# EAGLE design goodfet24 (EAGLE 5.08)
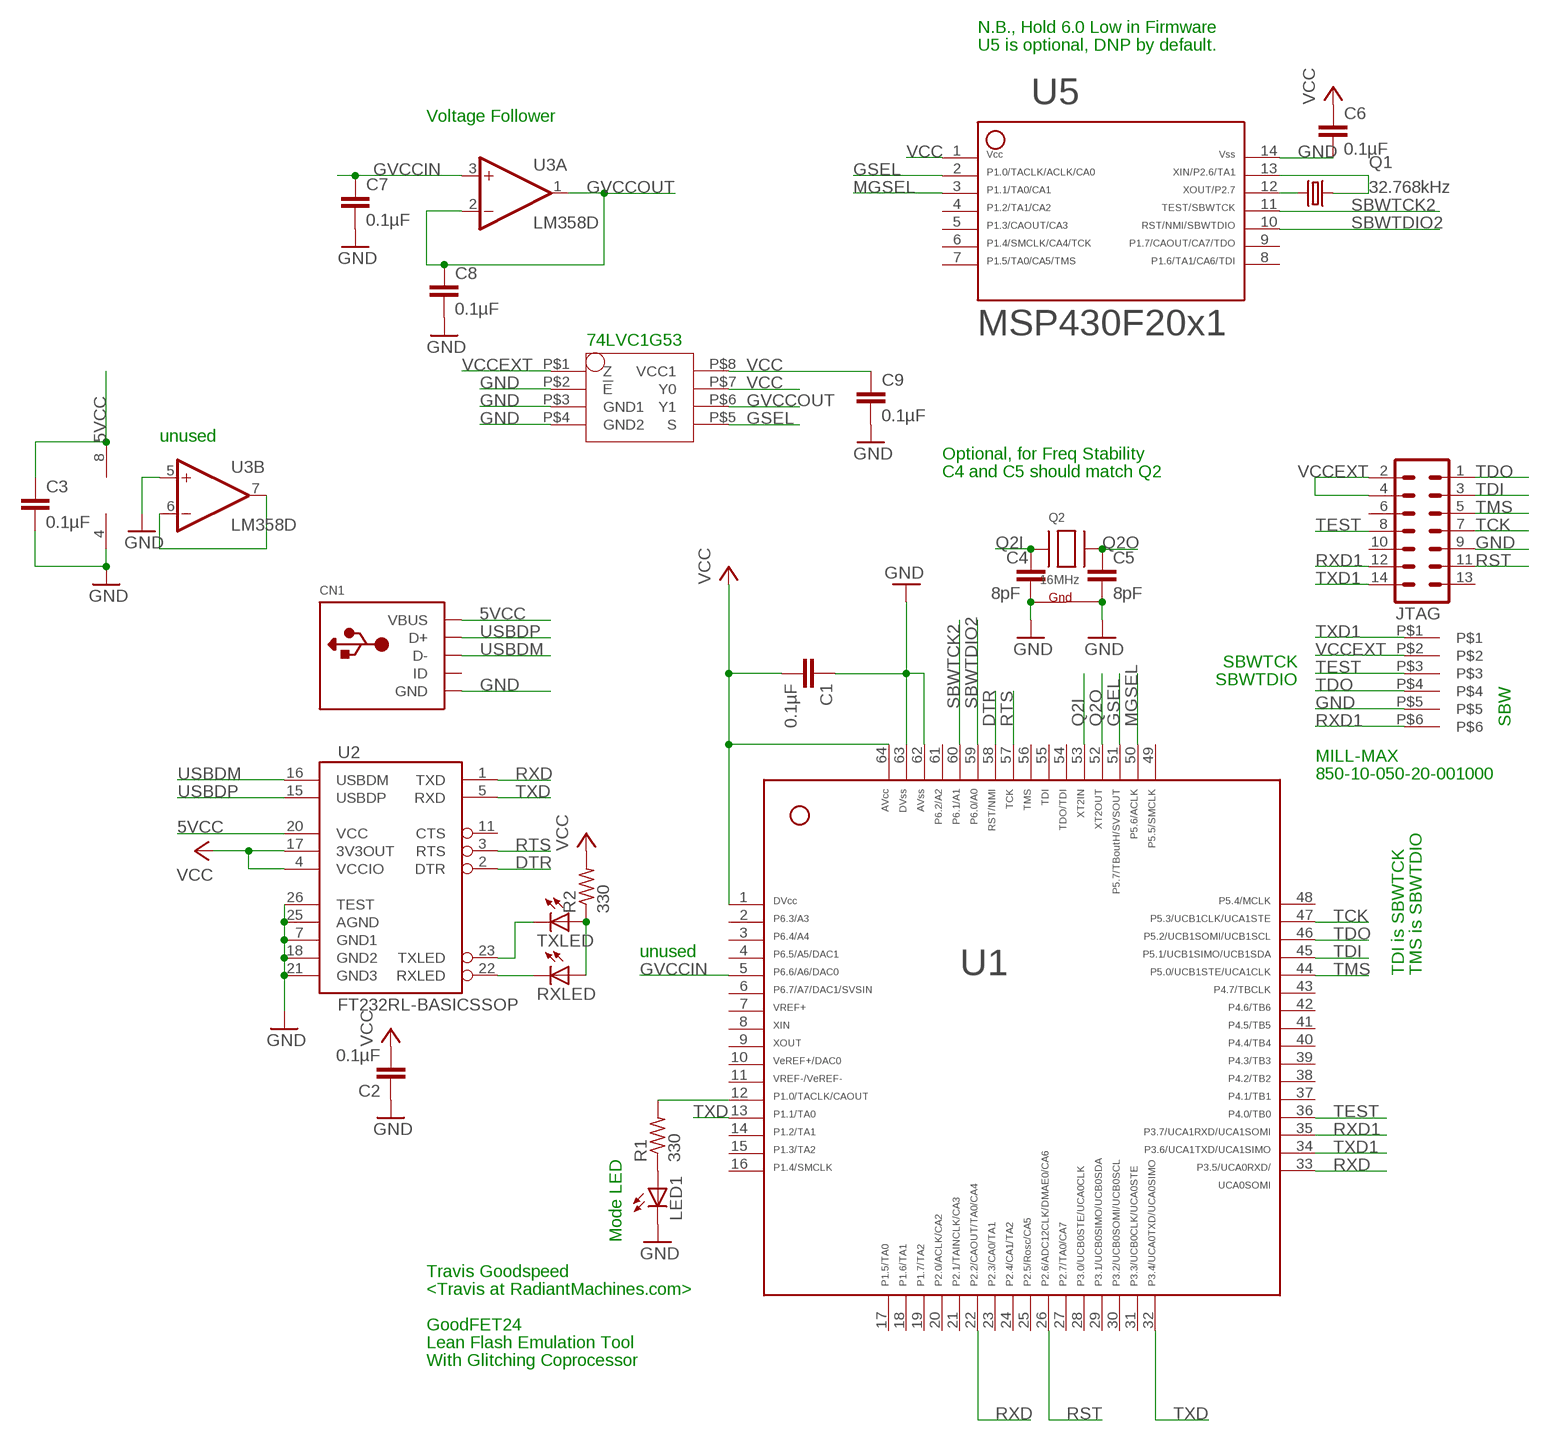
[diagram p0: schematic, sheet 1]

## Parts
C1  0.1µF  C-EUC0603  [C0603]
C2  0.1µF  C-EUC0603  [C0603]
C3  0.1µF  C-EUC0603  [C0603]
C4  8pF  C-EUC0603  [C0603]
C5  8pF  C-EUC0603  [C0603]
C6  0.1µF  C-EUC0603  [C0603]
C7  0.1µF  C-EUC0603  [C0603]
C8  0.1µF  C-EUC0603  [C0603]
C9  0.1µF  C-EUC0603  [C0603]
CN1  USBMINIB  [USB-MINIB]
JTAG  MA07-2  [MA07-2]
LED1  LEDCHIP-LED0603  [CHIP-LED0603]
Q1  32.768kHz  CRYSTALTC26H  [TC26H]
Q2  16MHz  XTAL-4-3225  [NX3225]
R1  330  R-US_R0603  [R0603]
R2  330  R-US_R0603  [R0603]
RXLED  LEDCHIP-LED0603  [CHIP-LED0603]
TXLED  LEDCHIP-LED0603  [CHIP-LED0603]
U1  F261X---PM64  [PM/PAG64]
U2  FT232RL-BASICSSOP  [SSOP28DB]
U3  LM358D  [SO08]
U4  74LV1G53  74LV1G53VSSOP8  [VSSOP8]
U5  MSP430F2001  F20X1---PW14  [PW14]
U$1  MILLMAX6  [MILLMAX85010004020001000]

## Nets
5VCC: C3.1 CN1.VBUS U2.20(VCC) U3.8(P:V+)
DTR: U1.58 U2.2(DTR)
GND: C1.1 C2.1 C3.2 C4.2 C5.2 C6.2 C7.2 C8.2 C9.2 CN1.GND JTAG.9 LED1.C Q2.2(G1) Q2.4(G2) U1.62 U1.63 U2.7(GND1) U2.18(GND2) U2.21(GND3) U2.25(AGND) U2.26(TEST) U3.4(P:V-) U3.5(B:+IN) U4.P$2(!E) U4.P$3(GND1) U4.P$4(GND2) U5.14 U$1.P$5
GSEL: U1.51 U4.P$5(S) U5.2
GVCCIN: C7.1 U1.5 U3.3(A:+IN)
GVCCOUT: C8.1 U3.1(A:OUT) U3.2(A:-IN) U4.P$6(Y1)
MGSEL: U1.50 U5.3
N$1: R1.2 U1.12
N$2: LED1.A R1.1
N$3: Q1.2 U5.12
N$4: Q1.1 U5.13
N$5: U3.6(B:-IN) U3.7(B:OUT)
N$6: RXLED.C U2.22(RXLED)
N$7: TXLED.C U2.23(TXLED)
N$8: R2.1 RXLED.A TXLED.A
Q2I: C4.1 Q2.1(X1) U1.53
Q2O: C5.1 Q2.3(X2) U1.52
RST: JTAG.11 U1.26
RTS: U1.57 U2.3(RTS)
RXD: U1.22 U1.33 U2.1(TXD)
RXD1: JTAG.12 U1.35 U$1.P$6
SBWTCK2: U1.60 U5.11
SBWTDIO2: U1.59 U5.10
TCK: JTAG.7 U1.47
TDI: JTAG.3 U1.45
TDO: JTAG.1 U1.46 U$1.P$4
TEST: JTAG.8 U1.36 U$1.P$3
TMS: JTAG.5 U1.44
TXD: U1.13 U1.32 U2.5(RXD)
TXD1: JTAG.14 U1.34 U$1.P$1
USBDM: CN1.D- U2.16(USBDM)
USBDP: CN1.D+ U2.15(USBDP)
VCC: C1.2 C2.2 C6.1 C9.1 R2.2 U1.1 U1.64 U2.4(VCCIO) U2.17(3V3OUT) U4.P$7(Y0) U4.P$8(VCC1) U5.1
VCCEXT: JTAG.2 JTAG.4 U4.P$1(Z) U$1.P$2
Unconnected: CN1.ID JTAG.6 JTAG.10 JTAG.13 U1.2 U1.3 U1.4 U1.6 U1.7 U1.8 U1.9 U1.10 U1.11 U1.14 U1.15 U1.16 U1.17 U1.18 U1.19 U1.20 U1.21 U1.23 U1.24 U1.25 U1.27 U1.28 U1.29 U1.30 U1.31 U1.37 U1.38 U1.39 U1.40 U1.41 U1.42 U1.43 U1.48 U1.49 U1.54 U1.55 U1.56 U1.61 U2.11(CTS) U5.4 U5.5 U5.6 U5.7 U5.8 U5.9

## Notes on the sheet
- N.B., Hold 6.0 Low in Firmware
- U5 is optional, DNP by default.
- Voltage Follower
- 74LVC1G53
- unused
- Optional, for Freq Stability
- C4 and C5 should match Q2
- SBWTCK
- SBWTDIO
- SBW
- MILL-MAX
- 850-10-050-20-001000
- unused
- TDI is SBWTCK | TMS is SBWTDIO
- Mode LED
- Travis Goodspeed
- <Travis at RadiantMachines.com>
- GoodFET24
- Lean Flash Emulation Tool
- With Glitching Coprocessor

## Library data of the parts
C1-C9 = rcl:C-EU: CAPACITOR, European symbol
CN1 = adafruit:USB: USB Connectors USBMINIB - Surface Mount Female Mini-B USB Connector 4UConnector: 06564 By microbuilder.eu Thru-hole RA Female Mini-B USB Connector 4UConnector: 18732 By ladyada.net
JTAG = con-lstb:MA07-2: PIN HEADER
LED1 RXLED TXLED = led:LED: LED OSRAM: - CHIPLED LG R971, LG N971, LY N971, LG Q971, LY Q971, LO R971, LY R971 LH N974, LH R974 LS Q976, LO Q976, LY Q976 LO Q996 - Hyper CHIPLED LW Q18S LB Q993, LB Q99A, LB R99A - SideLED LS A670, LO A670, LY A670, LG A670, LP A670 LB A673, LV A673, LT A673, LW A673 LH A674 LY A675 LS A676, LA A676, LO A676, LY A676, LW A676 LS A679, LY A679, LG A679 - Hyper Micro SIDELED® LS Y876, LA Y876, LO Y876, LY Y876 LT Y87S - SmartLED LW L88C, LW L88S LB L89C, LB L89S, LG L890 LS L89K, LO L89K, LY L89K LS L896, LA L896, LO L896, LY L896 - TOPLED LS T670, LO T670, LY T670, LG T670, LP T670 LSG T670, LSP T670, LSY T670, LOP T670, LYG T670 LG T671, LOG T671, LSG T671 LB T673, LV T673, LT T673, LW T673 LH T674 LS T676, LA T676, LO T676, LY T676, LB T676, LH T676, LSB T676, LW T676 LB T67C, LV T67C, LT T67C, LS T67K, LO T67K, LY T67K, LW E67C LS E67B, LA E67B, LO E67B, LY E67B, LB E67C, LV E67C, LT E67C LW T67C LS T679, LY T679, LG T679 LS T770, LO T770, LY T770, LG T770, LP T770 LB T773, LV T773, LT T773, LW T773 LH T774 LS E675, LA E675, LY E675, LS T675 LS T776, LA T776, LO T776, LY T776, LB T776 LHGB T686 LT T68C, LB T68C - Hyper Mini TOPLED® LB M676 - Mini TOPLED Santana® LG M470 LS M47K, LO M47K, LY M47K Source: http://www.osram.convergy.de LUXEON: - LUMILED® LXK2-PW12-R00, LXK2-PW12-S00, LXK2-PW14-U00, LXK2-PW14-V00 LXK2-PM12-R00, LXK2-PM12-S00, LXK2-PM14-U00 LXK2-PE12-Q00, LXK2-PE12-R00, LXK2-PE12-S00, LXK2-PE14-T00, LXK2-PE14-U00 LXK2-PB12-K00, LXK2-PB12-L00, LXK2-PB12-M00, LXK2-PB14-N00, LXK2-PB14-P00, LXK2-PB14-Q00 LXK2-PR12-L00, LXK2-PR12-M00, LXK2-PR14-Q00, LXK2-PR14-R00 LXK2-PD12-Q00, LXK2-PD12-R00, LXK2-PD12-S00 LXK2-PH12-R00, LXK2-PH12-S00 LXK2-PL12-P00, LXK2-PL12-Q00, LXK2-PL12-R00 Source: www.luxeon.com KINGBRIGHT: KA-3528ASYC Source: www.kingbright.com
Q1 = crystal:CRYSTAL: CRYSTAL
Q2 = adafruit:XTAL-4: Classic 4-pin 3.2 x 2.5mm crystal
R1 R2 = rcl:R-US_: RESISTOR, American symbol
U1 = TI_MSP430_v13:F261X---PM64: ***MSP430F261x***PM64
U2 = SparkFun:FT232RL-BASIC: USB UART This is the simplified version of the FT232RL unit. Only what you need, nothing you don't. Spark Fun Electronics SKU : COM-00650
U3 = linear:LM358: OP AMP also LM158; LM258; LM2904 Source: http://cache.national.com/ds/LM/LM158.pdf
U4 = adafruit:74LV1G53: Analog bi-directional MUX.
U5 = TI_MSP430_v15:F20X1---PW14: ***MSP430F20x1***PW14
U$1 = goodlib:MILLMAX6: 6-pin 0.050" header used for MSP430 SBW.

## Board
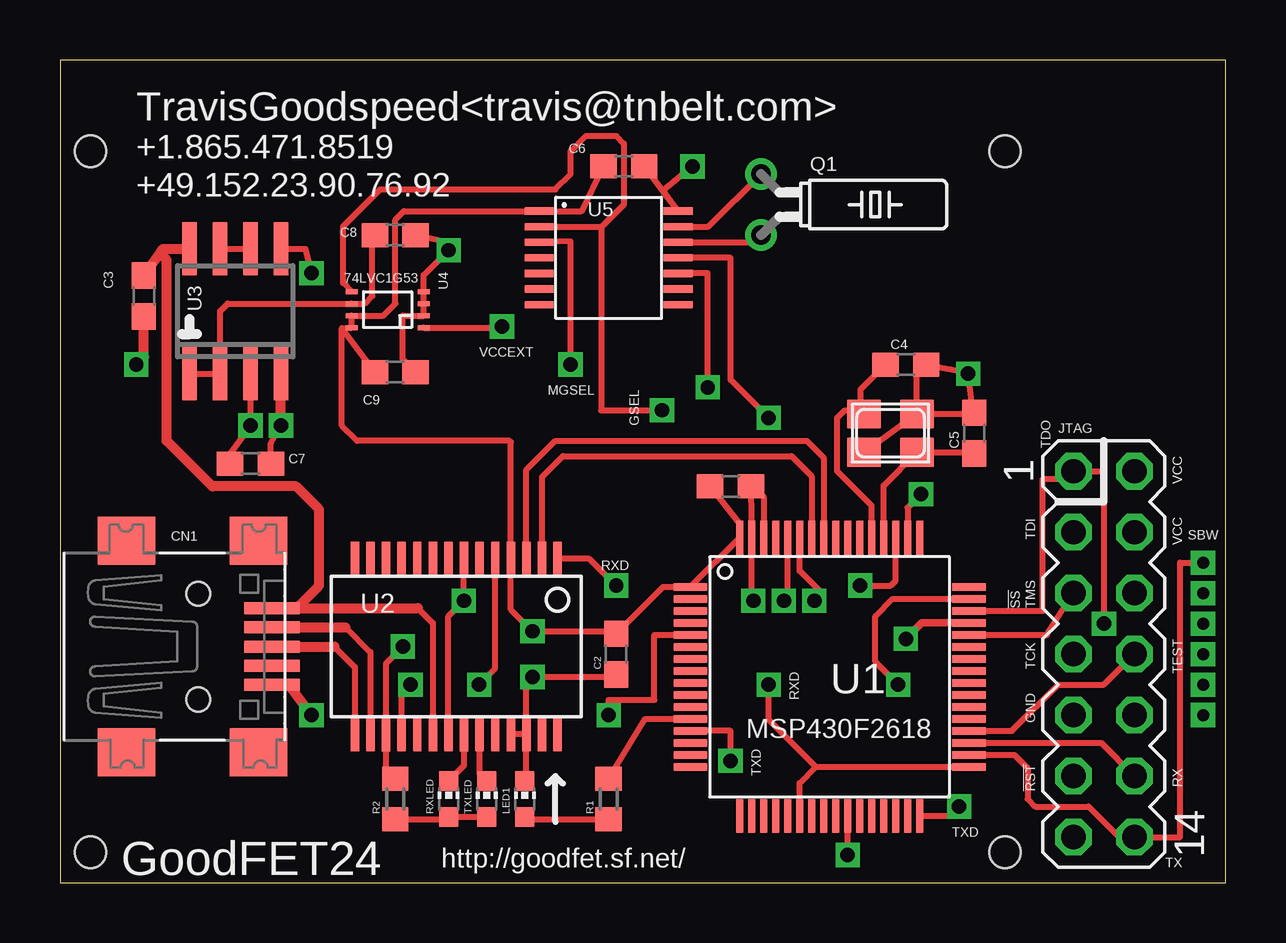
[diagram p1: board, top side]
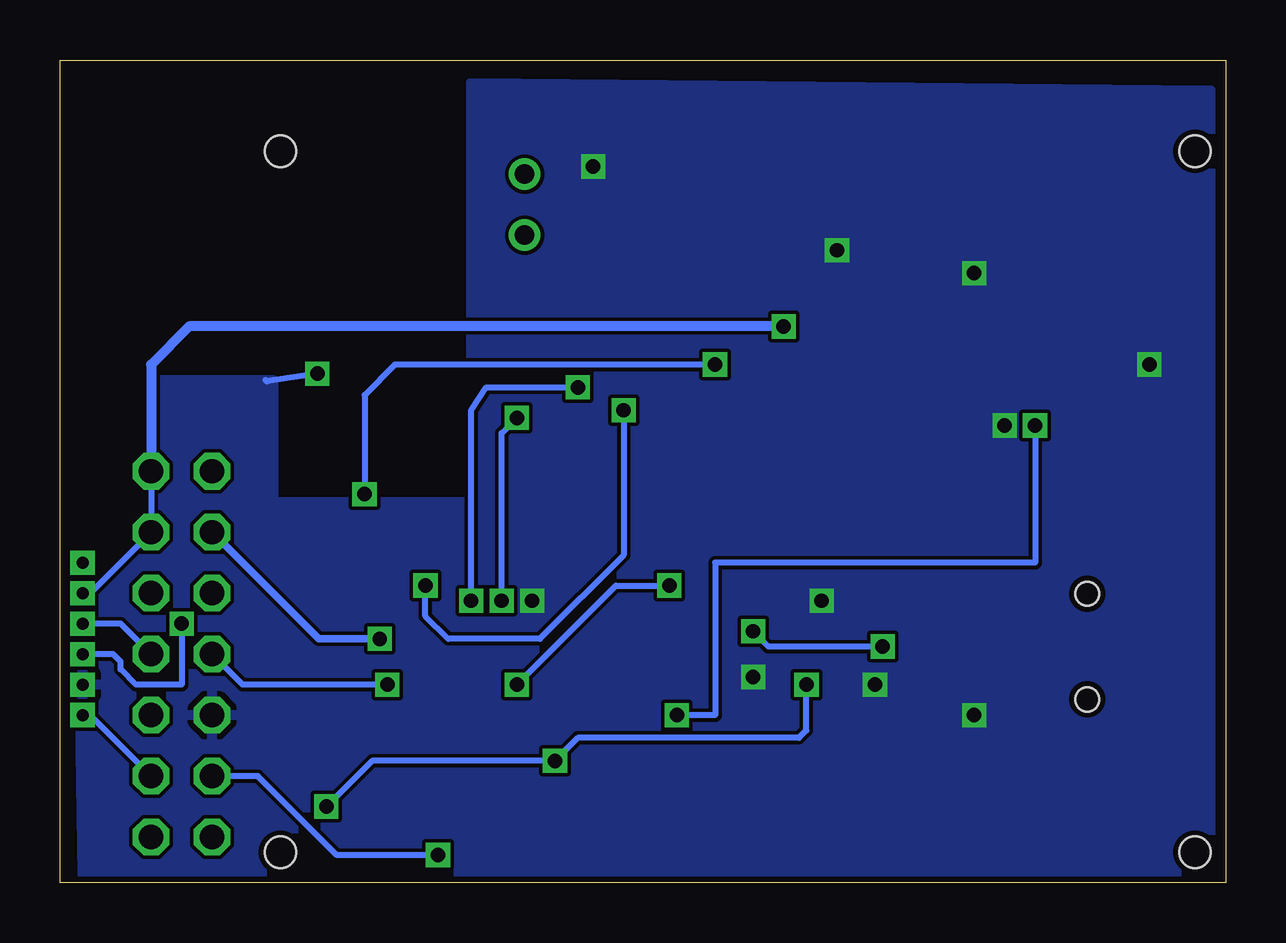
[diagram p2: board, bottom side, seen from below]

Size 48.56 x 34.28 mm. Coordinates in mm from the lower left corner, seen from the top.
Outline: 0,0 48.56,0 48.56,34.28 0,34.28 0,0
Copper layers (1*16): Top 0.035mm / dielectric 1.5mm / Bottom 0.035mm
Design rules "default *": minimum track width 8mil, minimum drill 8mil, track to track 6mil, track to pad 6mil, pad to pad 6mil, via to via 6mil, smd to smd 6mil, copper to edge 10mil, drill to drill 8mil, minimum pad ring 10mil, minimum via ring 8mil, stop-mask expansion 4mil, vias tented up to drill 0mil, thermal gap 10mil
Holes 1.3 mm at 1.27,1.27 1.27,30.48 39.37,30.48 39.37,1.27

### Footprints (pad centres in the part's own frame; a part is rotated, then mirrored left to right if it is on the bottom)
C0603 = smd 1.1 x 1: 1 -0.85,0; 2 0.85,0
USB-MINIB = smd 0.5 x 2.308: D+ 0,4.064; D- -0.8,4.064; GND 1.6,4.064; ID 0.8,4.064; VBUS -1.6,4.064 | smd 2 x 2.4: GND1 -4.4,-2; GND2 -4.4,3.5; GND3 4.4,3.5; GND4 4.4,-2 | hole 1: -2.2,1; 2.2,1
MA07-2 = drill 1.016 octagon: 1 -7.62,-1.27; 2 -7.62,1.27; 3 -5.08,-1.27; 4 -5.08,1.27; 5 -2.54,-1.27; 6 -2.54,1.27; 7 0,-1.27; 8 0,1.27; 9 2.54,-1.27; 10 2.54,1.27; 11 5.08,-1.27; 12 5.08,1.27; 13 7.62,-1.27; 14 7.62,1.27
CHIP-LED0603 = smd 0.8 x 0.8: A 0,-0.75; C 0,0.75
TC26H = drill 0.813 round: 1 -1.27,0; 2 1.27,0
NX3225 = smd 1.4 x 1.2: 1 -1.1,0.8; 2 1.1,0.8; 3 1.1,-0.8; 4 -1.1,-0.8
R0603 = smd 1 x 1.1: 1 -0.85,0; 2 0.85,0
PM/PAG64 = smd 1.4 x 0.3: 1 -5.8,3.75; 2 -5.8,3.25; 3 -5.8,2.75; 4 -5.8,2.25; 5 -5.8,1.75; 6 -5.8,1.25; 7 -5.8,0.75; 8 -5.8,0.25; 9 -5.8,-0.25; 10 -5.8,-0.75; 11 -5.8,-1.25; 12 -5.8,-1.75; 13 -5.8,-2.25; 14 -5.8,-2.75; 15 -5.8,-3.25; 16 -5.8,-3.75; 33 5.8,-3.75; 34 5.8,-3.25; 35 5.8,-2.75; 36 5.8,-2.25; 37 5.8,-1.75; 38 5.8,-1.25; 39 5.8,-0.75; 40 5.8,-0.25; 41 5.8,0.25; 42 5.8,0.75; 43 5.8,1.25; 44 5.8,1.75; 45 5.8,2.25; 46 5.8,2.75; 47 5.8,3.25; 48 5.8,3.75 | smd 0.3 x 1.4: 17 -3.75,-5.8; 18 -3.25,-5.8; 19 -2.75,-5.8; 20 -2.25,-5.8; 21 -1.75,-5.8; 22 -1.25,-5.8; 23 -0.75,-5.8; 24 -0.25,-5.8; 25 0.25,-5.8; 26 0.75,-5.8; 27 1.25,-5.8; 28 1.75,-5.8; 29 2.25,-5.8; 30 2.75,-5.8; 31 3.25,-5.8; 32 3.75,-5.8; 49 3.75,5.8; 50 3.25,5.8; 51 2.75,5.8; 52 2.25,5.8; 53 1.75,5.8; 54 1.25,5.8; 55 0.75,5.8; 56 0.25,5.8; 57 -0.25,5.8; 58 -0.75,5.8; 59 -1.25,5.8; 60 -1.75,5.8; 61 -2.25,5.8; 62 -2.75,5.8; 63 -3.25,5.8; 64 -3.75,5.8
SSOP28DB = smd 0.348 x 1.397: 1 -4.225,-3.656; 2 -3.575,-3.656; 3 -2.925,-3.656; 4 -2.275,-3.656; 5 -1.625,-3.656; 6 -0.975,-3.656; 7 -0.325,-3.656; 8 0.325,-3.656; 9 0.975,-3.656; 10 1.625,-3.656; 11 2.275,-3.656; 12 2.925,-3.656; 13 3.575,-3.656; 14 4.225,-3.656; 15 4.225,3.656; 16 3.575,3.656; 17 2.925,3.656; 18 2.275,3.656; 19 1.625,3.656; 20 0.975,3.656; 21 0.325,3.656; 22 -0.325,3.656; 23 -0.975,3.656; 24 -1.625,3.656; 25 -2.275,3.656; 26 -2.925,3.656; 27 -3.575,3.656; 28 -4.225,3.656
SO08 = smd 0.6 x 2.2: 1 -1.905,-2.6; 2 -0.635,-2.6; 3 0.635,-2.6; 4 1.905,-2.6; 5 1.905,2.6; 6 0.635,2.6; 7 -0.635,2.6; 8 -1.905,2.6
VSSOP8 = smd 0.5 x 0.203: P$1 -1.5,1; P$2 -1.5,0.5; P$3 -1.5,0; P$4 -1.5,-0.5; P$5 1.5,-0.5; P$6 1.5,0; P$7 1.5,0.5; P$8 1.5,1
PW14 = smd 0.3 x 1.2: 1 -1.95,-2.9; 2 -1.3,-2.9; 3 -0.65,-2.9; 4 0,-2.9; 5 0.65,-2.9; 6 1.3,-2.9; 7 1.95,-2.9; 8 1.95,2.9; 9 1.3,2.9; 10 0.65,2.9; 11 0,2.9; 12 -0.65,2.9; 13 -1.3,2.9; 14 -1.95,2.9
MILLMAX85010004020001000 = drill 0.5 pad 0.61 square: P$1 0,3.81; P$2 0,2.54; P$3 0,1.27; P$4 0,0; P$5 0,-1.27; P$6 0,-2.54

### Placement (x,y rotation side)
C1  27.94,16.51 180 top
C2  23.18,9.53 90 top
C3  3.49,24.45 270 top
C4  35.24,21.59 0 top
C5  38.1,18.73 90 top
C6  23.5,29.84 0 top
C7  7.94,17.46 0 top
C8  13.97,26.99 0 top
C9  13.97,21.27 0 top
CN1  4.76,9.84 270 top
JTAG  43.5,9.53 270 top
LED1  19.37,3.49 0 top
Q1  29.21,28.26 270 top
Q2  34.61,18.73 0 top
R1  22.86,3.49 90 top
R2  13.97,3.49 90 top
RXLED  16.19,3.49 0 top
TXLED  17.78,3.49 0 top
U1  32.07,8.57 0 top
U2  16.51,9.84 180 top
U3  7.3,23.81 0 top
U4  13.65,24.13 180 top
U5  22.86,26.04 270 top
U$1  47.62,9.53 0 top

### Tracks (layer width: path | path; a pad name or v marks a point on that pad's centre or on a via)
5VCC
  Top 0.254: U2.20 15.54,10.82 14.91,11.44
  Top 0.406: 14.91,11.44 CN1.VBUS 9.86,11.44 10.79,12.38 10.79,15.56 9.84,16.51 6.35,16.51 4.45,18.41 4.45,25.95 4.16,26.24 | U3.8 4.29,26.41 4.16,26.24 | 4.16,26.24 C3.1
DTR
  Top 0.254: U2.2 20.09,16.91 20.95,17.78 30.48,17.78 31.32,16.94 U1.58
GND  (via drill 0.6)
  Top 0.254: U2.26 U2.25 | U2.26 19.43,8.32 v19.68,8.57 23.28,8.57 C2.1 | U2.18 14.23,8.2 v14.61,8.26 | U2.7 16.84,13.34 16.83,13.34 v16.83,11.75 16.18,11.11 U2.21 | U2.26 19.43,4.63 LED1.C | U1.62 29.32,16.09 C1.1 28.82,15.59 U1.63 28.82,11.82 v28.89,11.75 | Q2.2 35.71,21.2 C4.2 37.78,21.27 v37.84,21.21 38.05,19.53 | Q2.2 38.05,19.53 | 38.05,19.53 C5.2 | Q2.4 Q2.2 | C6.2 25.25,28.62 U5.14 25.12,28.85 v26.35,29.84 | C7.2 8.79,18.31 v9.21,19.05 | C8.2 16.19,26.67 v16.19,26.35 15.15,25.31 U4.P$4 U4.P$3 U4.P$2 14.29,23.63 14.29,21.8 C9.2 | U3.5 10.22,26.41 v10.48,25.4
  Top 0.406: CN1.GND 9.54,8.24 v10.48,6.99 | v9.21,19.05 U3.4 | C3.2 3.49,21.91 v3.17,21.59
  Bottom 0.254: v37.84,21.21 39.94,20.89 40.01,20.95
  pour Bottom: 0.64,0.32 47.62,0.32 47.94,20.95 39.69,20.95 39.69,15.88 31.43,15.88 31.43,33.34 0.64,33.02
GSEL  (via drill 0.6)
  Top 0.254: v25.08,19.68 22.54,19.68 22.54,27.3 | 22.54,27.3 19.67,27.3 U5.2 | 22.54,27.3 23.5,28.26 23.5,30.8 23.18,31.11 21.91,31.11 21.27,30.48 21.27,29.53 20.64,28.89 13.34,28.89 11.79,27.35 11.79,24.99 U4.P$5 | U1.51 34.82,12.59 34.61,12.38 v33.34,12.38
  Bottom 0.254: v33.34,12.38 33.34,11.11 32.38,10.16 28.57,10.16 25.08,13.65 v25.08,19.68
GVCCIN  (via drill 0.6)
  Top 0.254: U1.5 24.77,10.32 24.77,7.62 22.86,7.62 v22.86,6.99 | U3.3 v7.94,19.05 7.09,17.88 C7.1
  Bottom 0.254: v22.86,6.99 21.27,6.99 21.27,13.34 7.94,13.34 v7.94,19.05
GVCCOUT
  Top 0.254: U3.1 U3.2 6.67,23.81 6.99,24.13 U4.P$6 12.7,24.13 13.02,24.45 13.02,26.57 C8.1
MGSEL  (via drill 0.6)
  Top 0.254: U1.50 35.32,15.63 v35.88,16.19 | v21.27,21.59 21.27,26.73 U5.3
  Bottom 0.254: v35.88,16.19 35.88,20.32 34.61,21.59 v21.27,21.59
N$1
  Top 0.254: U1.12 24.39,6.82 R1.2
N$2
  Top 0.254: R1.1 19.37,2.64 LED1.A
N$3
  Top 0.254: U5.12 28.91,26.68 Q1.2
N$4
  Top 0.254: U5.13 27.02,27.34 Q1.1
N$5
  Top 0.254: U3.7 U3.6
N$6
  Top 0.254: U2.22 16.84,4.88 RXLED.C
N$7
  Top 0.254: U2.23 17.48,4.54 TXLED.C
N$8
  Top 0.254: R2.1 16.09,2.64 RXLED.A TXLED.A
Q2I
  Top 0.254: U1.53 33.82,15.71 32.38,17.14 32.38,19.37 32.7,19.68 33.35,19.68 | 33.35,19.68 Q2.1 | 33.35,19.68 33.35,20.55 C4.1
Q2O
  Top 0.254: U1.52 34.32,16.54 Q2.3 38.05,17.93 C5.1
RST  (via drill 0.6)
  Top 0.254: v32.82,1.16 U1.26
  Bottom 0.254: JTAG.11 40.32,4.45 37.03,1.16 v32.82,1.16
RTS
  Top 0.254: U2.3 19.43,17.21 20.64,18.41 31.11,18.41 31.82,17.71 U1.57
RXD  (via drill 0.6)
  Top 0.254: 31.49,4.82 U1.33 | U1.22 30.82,4.15 31.49,4.82 | U2.1 22.06,13.5 v23.18,12.38 | v29.53,8.26 29.53,6.79 31.49,4.82
  Bottom 0.254: v23.18,12.38 25.4,12.38 v29.53,8.26
RXD1
  Top 0.254: U1.35 43.39,5.82 JTAG.12
  Bottom 0.254: JTAG.12 47.31,6.99 U$1.P$6
SBWTCK2  (via drill 0.6)
  Top 0.254: U1.60 30.32,11.9 v30.16,11.75 | v29.53,19.37 27.94,20.95 27.94,26.04 U5.11
  Bottom 0.254: v30.16,11.75 30.16,18.73 v29.53,19.37
SBWTDIO2  (via drill 0.6)
  Top 0.254: U1.59 30.82,13 31.75,12.06 v31.43,11.75 | v26.99,20.64 26.99,25.4 25.46,25.4 U5.10
  Bottom 0.254: v31.43,11.75 31.43,19.68 30.8,20.64 v26.99,20.64
TCK  (via drill 0.6)
  Top 0.254: U1.47 34.68,11.82 33.97,11.11 33.97,9.21 v34.92,8.26
  Bottom 0.254: v34.92,8.26 40.96,8.26 JTAG.7
TDI  (via drill 0.6)
  Top 0.305: U1.45 35.91,10.82 v35.24,10.16
  Bottom 0.305: v35.24,10.16 37.78,10.16 JTAG.3
TDO  (via drill 0.6)
  Top 0.254: U1.46 40.96,11.32 40.96,16.83 42.23,16.83 JTAG.1 43.5,17.14 v43.5,10.79
  Bottom 0.254: v43.5,10.79 43.5,8.26 45.4,8.26 46.04,8.89 46.04,9.21 46.35,9.53 U$1.P$4
TEST
  Top 0.254: U1.36 39.66,6.32 41.59,8.26 43.5,8.26 JTAG.8
  Bottom 0.254: JTAG.8 46.04,10.79 U$1.P$3
TMS
  Top 0.254: U1.44 41.12,10.32 JTAG.5
TXD  (via drill 0.6)
  Top 0.254: U2.5 18.14,8.93 v17.46,8.26 | U1.32 37.06,2.77 v37.47,3.17 | U1.13 27.94,6.32 v27.94,5.08
  Bottom 0.254: v17.46,8.26 17.46,6.35 17.78,6.03 26.99,6.03 v27.94,5.08 35.56,5.08 v37.47,3.17
TXD1
  Top 0.254: U1.34 39.76,5.32 40.32,4.76 40.32,3.49 40.64,3.17 42.86,3.17 44.13,1.91 JTAG.14 46.67,1.91 46.67,13.34 U$1.P$1
USBDM
  Top 0.254: U2.16 12.94,9.61 11.9,10.64
  Top 0.406: CN1.D- 11.9,10.64
USBDP
  Top 0.254: U2.15 12.29,8.99 11.43,9.84
  Top 0.406: CN1.D+ 11.43,9.84
VCC  (via drill 0.6)
  Top 0.254: v14.29,9.84 13.59,9.14 U2.17 13.59,4.73 R2.2 | C1.2 28.32,14.96 U1.64 U1.1 25.12,12.32 C2.2 23.07,10.48 v19.68,10.48 18.79,11.38 U2.4 18.79,18.36 18.73,18.41 12.38,18.41 11.75,19.05 11.75,23.11 | 11.75,23.11 U4.P$8 U4.P$7 13.47,23.63 13.97,24.13 13.97,27.62 14.33,27.98 U5.1 21.74,27.98 C6.1 | 11.75,23.11 C9.1
  Bottom 0.254: v14.29,9.84 19.05,9.84 v19.68,10.48
VCCEXT  (via drill 0.6)
  Top 0.254: 18.07,23.16 v18.41,23.18 18.41,23.13 U4.P$1
  Bottom 0.254: U$1.P$2 47.31,12.06 JTAG.4 JTAG.2
  Bottom 0.406: v18.41,23.18 43.18,23.18 44.77,21.59 JTAG.2

### Text on the board
tNames: TravisGoodspeed<travis@tnbelt.com> | +1.865.471.8519 | +49.152.23.90.76.92 | 74LVC1G53 | VCCEXT | MGSEL | GSEL | JTAG | TDO | VCC | VCC | TDI | SBW | RXD | !SS | TMS | TEST | TCK | RXD | GND | MSP430F2618 | RX | TXD | !RST | TXD | http://goodfet.sf.net/ | TX | GoodFET24